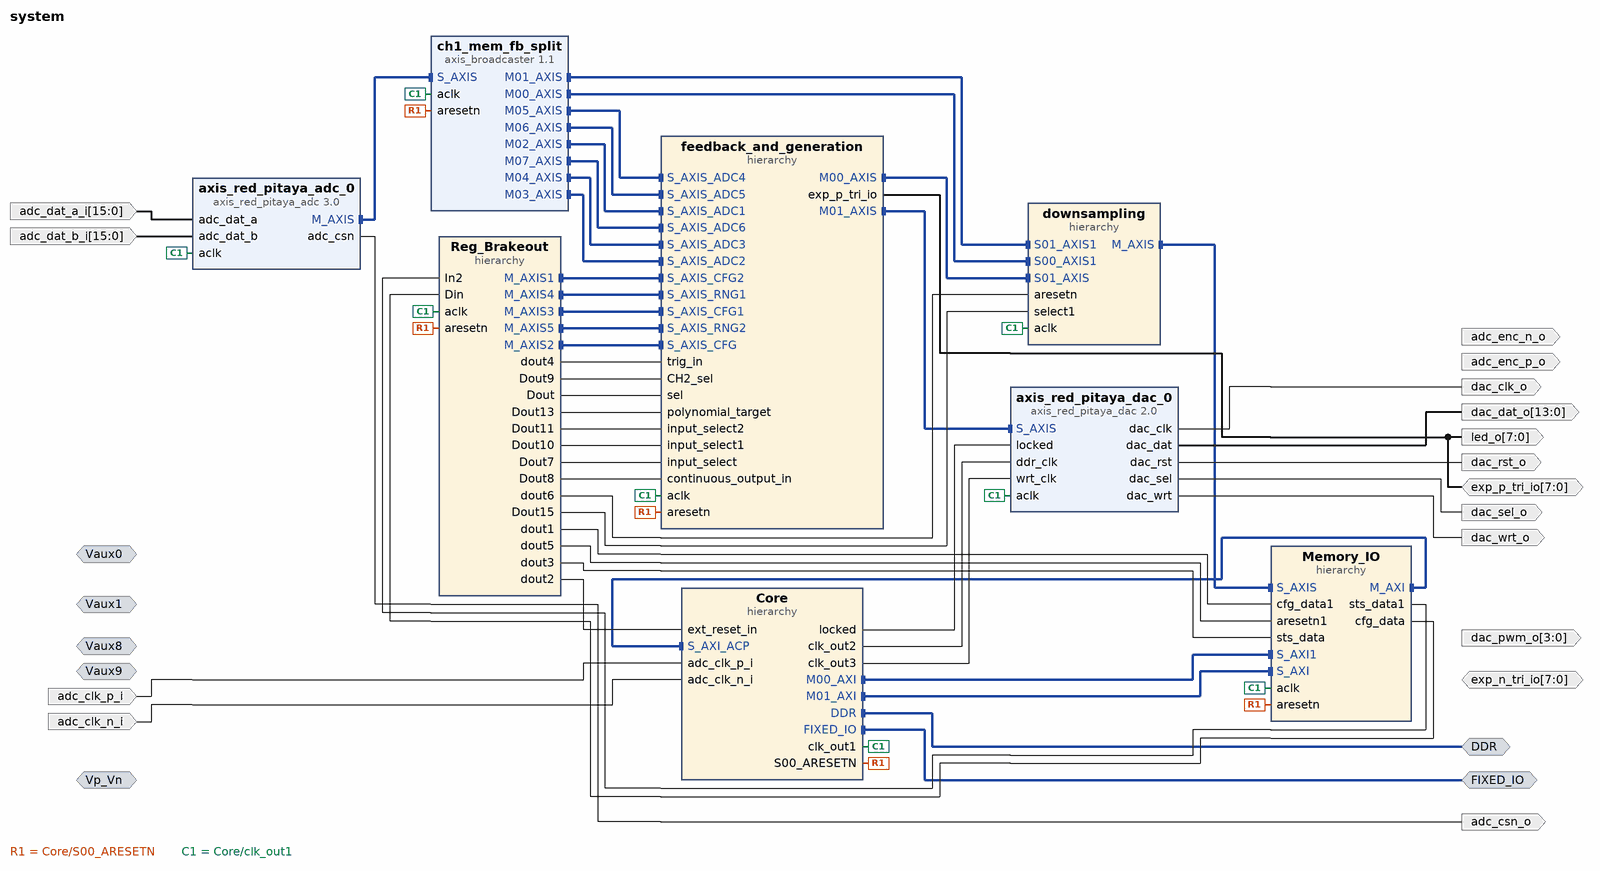
[diagram p0: block diagram of the top level]
# Vivado block design system, xc7z010clg400-1, Vivado 2020.2
create_bd_design system

create_bd_intf_port -mode Slave -vlnv xilinx.com:interface:diff_analog_io_rtl:1.0 Vp_Vn
create_bd_intf_port -mode Slave -vlnv xilinx.com:interface:diff_analog_io_rtl:1.0 Vaux0
create_bd_intf_port -mode Slave -vlnv xilinx.com:interface:diff_analog_io_rtl:1.0 Vaux1
create_bd_intf_port -mode Slave -vlnv xilinx.com:interface:diff_analog_io_rtl:1.0 Vaux9
create_bd_intf_port -mode Slave -vlnv xilinx.com:interface:diff_analog_io_rtl:1.0 Vaux8
create_bd_intf_port -mode Master -vlnv xilinx.com:interface:ddrx_rtl:1.0 DDR
create_bd_intf_port -mode Master -vlnv xilinx.com:display_processing_system7:fixedio_rtl:1.0 FIXED_IO
create_bd_port -dir I -from 15 -to 0 adc_dat_a_i
create_bd_port -dir I -from 15 -to 0 adc_dat_b_i
create_bd_port -dir I adc_clk_p_i
create_bd_port -dir I adc_clk_n_i
create_bd_port -dir O adc_enc_p_o
create_bd_port -dir O adc_enc_n_o
create_bd_port -dir O adc_csn_o
create_bd_port -dir O -from 13 -to 0 dac_dat_o
create_bd_port -dir O dac_clk_o
create_bd_port -dir O dac_rst_o
create_bd_port -dir O dac_sel_o
create_bd_port -dir O dac_wrt_o
create_bd_port -dir O -from 3 -to 0 dac_pwm_o
create_bd_port -dir IO -from 7 -to 0 exp_p_tri_io
create_bd_port -dir IO -from 7 -to 0 exp_n_tri_io
create_bd_port -dir O -from 7 -to 0 led_o

create_bd_cell -type hier Core
create_bd_cell -type hier Memory_IO
create_bd_cell -type hier Reg_Brakeout
create_bd_cell -type ip -vlnv xilinx.com:user:axis_red_pitaya_adc:3.0 axis_red_pitaya_adc_0
create_bd_cell -type ip -vlnv xilinx.com:ip:axis_broadcaster:1.1 ch1_mem_fb_split
set_property -dict [list \
  CONFIG.M00_TDATA_REMAP {tdata[15:0]} \
  CONFIG.M01_TDATA_REMAP {tdata[31:16]} \
  CONFIG.M02_TDATA_REMAP {tdata[15:0]} \
  CONFIG.M03_TDATA_REMAP {tdata[31:16]} \
  CONFIG.M04_TDATA_REMAP {tdata[15:0]} \
  CONFIG.M05_TDATA_REMAP {tdata[31:16]} \
  CONFIG.M06_TDATA_REMAP {tdata[15:0]} \
  CONFIG.M07_TDATA_REMAP {tdata[31:16]} \
  CONFIG.M_TDATA_NUM_BYTES 2 \
  CONFIG.NUM_MI 8 \
  CONFIG.S_TDATA_NUM_BYTES 4 \
] [get_bd_cells ch1_mem_fb_split]
create_bd_cell -type hier feedback_and_generation
create_bd_cell -type ip -vlnv xilinx.com:user:axis_red_pitaya_dac:2.0 axis_red_pitaya_dac_0
create_bd_cell -type hier downsampling

# ---- hierarchy /Core ----
current_bd_instance /Core
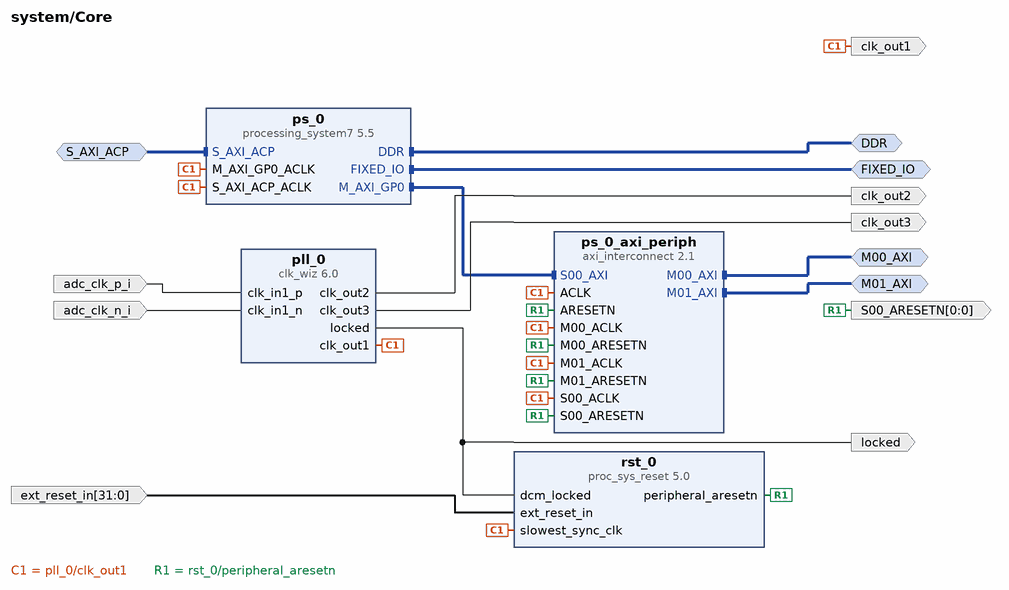
[diagram p1: block diagram inside /Core]
create_bd_intf_pin -mode Master -vlnv xilinx.com:interface:ddrx_rtl:1.0 DDR
create_bd_intf_pin -mode Master -vlnv xilinx.com:display_processing_system7:fixedio_rtl:1.0 FIXED_IO
create_bd_intf_pin -mode Slave -vlnv xilinx.com:interface:aximm_rtl:1.0 S_AXI_ACP
create_bd_intf_pin -mode Master -vlnv xilinx.com:interface:aximm_rtl:1.0 M00_AXI
create_bd_intf_pin -mode Master -vlnv xilinx.com:interface:aximm_rtl:1.0 M01_AXI
create_bd_pin -dir O -type clk clk_out1
create_bd_pin -dir I -from 31 -to 0 -type rst ext_reset_in
create_bd_pin -dir O locked
create_bd_pin -dir O -from 0 -to 0 -type rst S00_ARESETN
create_bd_pin -dir I adc_clk_p_i
create_bd_pin -dir I adc_clk_n_i
create_bd_pin -dir O -type clk clk_out2
create_bd_pin -dir O -type clk clk_out3

create_bd_cell -type ip -vlnv xilinx.com:ip:proc_sys_reset:5.0 rst_0
create_bd_cell -type ip -vlnv xilinx.com:ip:clk_wiz:6.0 pll_0
set_property -dict [list \
  CONFIG.CLKOUT1_REQUESTED_OUT_FREQ 125.0 \
  CONFIG.CLKOUT1_USED true \
  CONFIG.CLKOUT2_REQUESTED_OUT_FREQ 250.0 \
  CONFIG.CLKOUT2_REQUESTED_PHASE 157.5 \
  CONFIG.CLKOUT2_USED true \
  CONFIG.CLKOUT3_REQUESTED_OUT_FREQ 250.0 \
  CONFIG.CLKOUT3_REQUESTED_PHASE 202.5 \
  CONFIG.CLKOUT3_USED true \
  CONFIG.CLKOUT4_JITTER 119.348 \
  CONFIG.CLKOUT4_PHASE_ERROR 96.948 \
  CONFIG.CLKOUT4_REQUESTED_OUT_FREQ 100.000 \
  CONFIG.CLKOUT4_USED false \
  CONFIG.CLKOUT5_JITTER 119.348 \
  CONFIG.CLKOUT5_PHASE_ERROR 96.948 \
  CONFIG.CLKOUT5_REQUESTED_OUT_FREQ 100.000 \
  CONFIG.CLKOUT5_USED false \
  CONFIG.CLKOUT6_JITTER 119.348 \
  CONFIG.CLKOUT6_PHASE_ERROR 96.948 \
  CONFIG.CLKOUT6_REQUESTED_OUT_FREQ 100.000 \
  CONFIG.CLKOUT6_USED false \
  CONFIG.MMCM_CLKOUT3_DIVIDE 1 \
  CONFIG.MMCM_CLKOUT4_DIVIDE 1 \
  CONFIG.MMCM_CLKOUT5_DIVIDE 1 \
  CONFIG.NUM_OUT_CLKS 3 \
  CONFIG.PRIMITIVE PLL \
  CONFIG.PRIM_IN_FREQ 125.0 \
  CONFIG.PRIM_SOURCE Differential_clock_capable_pin \
  CONFIG.USE_RESET false \
] [get_bd_cells pll_0]
create_bd_cell -type ip -vlnv xilinx.com:ip:processing_system7:5.5 ps_0
set_property -dict [list \
  CONFIG.PCW_APU_PERIPHERAL_FREQMHZ 666.666666 \
  CONFIG.PCW_ENET0_ENET0_IO {MIO 16 .. 27} \
  CONFIG.PCW_ENET0_GRP_MDIO_ENABLE 1 \
  CONFIG.PCW_ENET0_GRP_MDIO_IO {MIO 52 .. 53} \
  CONFIG.PCW_ENET0_PERIPHERAL_ENABLE 1 \
  CONFIG.PCW_ENET0_RESET_ENABLE 0 \
  CONFIG.PCW_ENET_RESET_ENABLE 1 \
  CONFIG.PCW_ENET_RESET_SELECT {Share reset pin} \
  CONFIG.PCW_FPGA0_PERIPHERAL_FREQMHZ 50 \
  CONFIG.PCW_FPGA1_PERIPHERAL_FREQMHZ 50 \
  CONFIG.PCW_GPIO_EMIO_GPIO_ENABLE 1 \
  CONFIG.PCW_GPIO_EMIO_GPIO_IO 64 \
  CONFIG.PCW_GPIO_MIO_GPIO_ENABLE 1 \
  CONFIG.PCW_GPIO_MIO_GPIO_IO MIO \
  CONFIG.PCW_GPIO_PERIPHERAL_ENABLE 1 \
  CONFIG.PCW_I2C0_GRP_INT_ENABLE 0 \
  CONFIG.PCW_I2C0_I2C0_IO {MIO 50 .. 51} \
  CONFIG.PCW_I2C0_PERIPHERAL_ENABLE 1 \
  CONFIG.PCW_I2C_PERIPHERAL_FREQMHZ 111.111115 \
  CONFIG.PCW_I2C_RESET_ENABLE 1 \
  CONFIG.PCW_I2C_RESET_SELECT {Share reset pin} \
  CONFIG.PCW_IMPORT_BOARD_PRESET cfg/red_pitaya.xml \
  CONFIG.PCW_PRESET_BANK1_VOLTAGE {LVCMOS 2.5V} \
  CONFIG.PCW_QSPI_PERIPHERAL_ENABLE 0 \
  CONFIG.PCW_SD0_GRP_CD_ENABLE 1 \
  CONFIG.PCW_SD0_GRP_CD_IO {MIO 46} \
  CONFIG.PCW_SD0_GRP_WP_ENABLE 1 \
  CONFIG.PCW_SD0_GRP_WP_IO {MIO 47} \
  CONFIG.PCW_SD0_PERIPHERAL_ENABLE 1 \
  CONFIG.PCW_SD0_SD0_IO {MIO 40 .. 45} \
  CONFIG.PCW_SDIO_PERIPHERAL_FREQMHZ 100 \
  CONFIG.PCW_SPI0_PERIPHERAL_ENABLE 1 \
  CONFIG.PCW_SPI0_SPI0_IO EMIO \
  CONFIG.PCW_SPI1_PERIPHERAL_ENABLE 1 \
  CONFIG.PCW_SPI1_SPI1_IO {MIO 10 .. 15} \
  CONFIG.PCW_UART0_PERIPHERAL_ENABLE 1 \
  CONFIG.PCW_UART0_UART0_IO {MIO 14 .. 15} \
  CONFIG.PCW_UART1_PERIPHERAL_ENABLE 1 \
  CONFIG.PCW_UART1_UART1_IO {MIO 8 .. 9} \
  CONFIG.PCW_UART_PERIPHERAL_FREQMHZ 100 \
  CONFIG.PCW_UIPARAM_DDR_BUS_WIDTH {16 Bit} \
  CONFIG.PCW_UIPARAM_DDR_FREQ_MHZ 533.333333 \
  CONFIG.PCW_UIPARAM_DDR_PARTNO {MT41J256M16 RE-125} \
  CONFIG.PCW_USB0_PERIPHERAL_ENABLE 1 \
  CONFIG.PCW_USB0_RESET_ENABLE 1 \
  CONFIG.PCW_USB0_RESET_IO {MIO 48} \
  CONFIG.PCW_USB0_USB0_IO {MIO 28 .. 39} \
  CONFIG.PCW_USB_RESET_ENABLE 1 \
  CONFIG.PCW_USB_RESET_SELECT {Share reset pin} \
  CONFIG.PCW_USE_DEFAULT_ACP_USER_VAL 1 \
  CONFIG.PCW_USE_S_AXI_ACP 1 \
] [get_bd_cells ps_0]
# 429 more settings of ps_0 are not shown: defaults, MIO pin electricals, DDR timing, and values the tool derives
create_bd_cell -type ip -vlnv xilinx.com:ip:axi_interconnect:2.1 ps_0_axi_periph
set_property -dict {CONFIG.NUM_MI 2} [get_bd_cells ps_0_axi_periph]

# ---- hierarchy /Memory_IO ----
current_bd_instance /Memory_IO
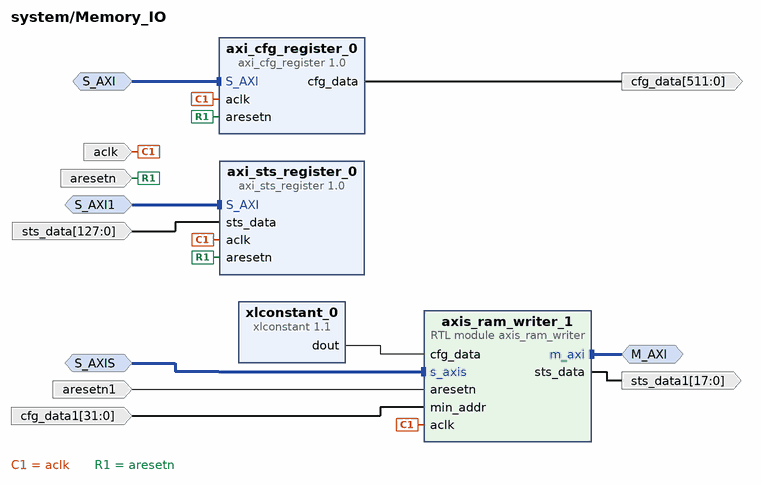
[diagram p2: block diagram inside /Memory_IO]
create_bd_intf_pin -mode Slave -vlnv xilinx.com:interface:aximm_rtl:1.0 S_AXI
create_bd_intf_pin -mode Slave -vlnv xilinx.com:interface:aximm_rtl:1.0 S_AXI1
create_bd_intf_pin -mode Slave -vlnv xilinx.com:interface:axis_rtl:1.0 S_AXIS
create_bd_intf_pin -mode Master -vlnv xilinx.com:interface:aximm_rtl:1.0 M_AXI
create_bd_pin -dir I -type clk aclk
create_bd_pin -dir I -type rst aresetn
create_bd_pin -dir I -from 127 -to 0 sts_data
create_bd_pin -dir I -type rst aresetn1
create_bd_pin -dir I -from 31 -to 0 cfg_data1
create_bd_pin -dir O -from 17 -to 0 sts_data1
create_bd_pin -dir O -from 511 -to 0 cfg_data

create_bd_cell -type ip -vlnv xilinx.com:user:axi_sts_register:1.0 axi_sts_register_0
set_property -dict {CONFIG.AXI_ADDR_WIDTH 32 CONFIG.STS_DATA_WIDTH 128} [get_bd_cells axi_sts_register_0]
create_bd_cell -type ip -vlnv xilinx.com:user:axi_cfg_register:1.0 axi_cfg_register_0
set_property -dict {CONFIG.AXI_ADDR_WIDTH 32 CONFIG.CFG_DATA_WIDTH 512} [get_bd_cells axi_cfg_register_0]
create_bd_cell -type ip -vlnv xilinx.com:ip:xlconstant:1.1 xlconstant_0
set_property -dict {CONFIG.CONST_VAL 65535 CONFIG.CONST_WIDTH 18} [get_bd_cells xlconstant_0]
create_bd_cell -type module -reference axis_ram_writer axis_ram_writer_1
set_property -dict {CONFIG.ADDR_WIDTH 18 CONFIG.AXI_ID_WIDTH 3} [get_bd_cells axis_ram_writer_1]

# ---- hierarchy /Reg_Brakeout ----
current_bd_instance /Reg_Brakeout
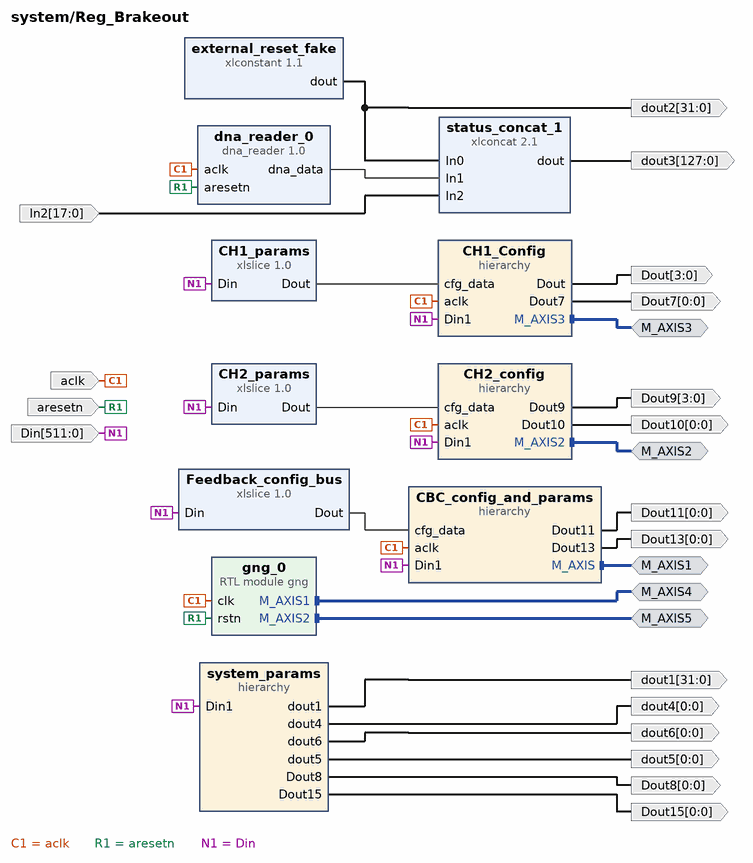
[diagram p3: block diagram inside /Reg_Brakeout]
create_bd_intf_pin -mode Master -vlnv xilinx.com:interface:axis_rtl:1.0 M_AXIS2
create_bd_intf_pin -mode Master -vlnv xilinx.com:interface:axis_rtl:1.0 M_AXIS3
create_bd_intf_pin -mode Master -vlnv xilinx.com:interface:axis_rtl:1.0 M_AXIS1
create_bd_intf_pin -mode Master -vlnv xilinx.com:interface:axis_rtl:1.0 M_AXIS4
create_bd_intf_pin -mode Master -vlnv xilinx.com:interface:axis_rtl:1.0 M_AXIS5
create_bd_pin -dir I -type clk aclk
create_bd_pin -dir I -type rst aresetn
create_bd_pin -dir O -from 31 -to 0 dout1
create_bd_pin -dir O -from 31 -to 0 dout2
create_bd_pin -dir O -from 0 -to 0 dout4
create_bd_pin -dir O -from 0 -to 0 dout5
create_bd_pin -dir O -from 0 -to 0 dout6
create_bd_pin -dir O -from 0 -to 0 Dout8
create_bd_pin -dir O -from 127 -to 0 dout3
create_bd_pin -dir I -from 17 -to 0 In2
create_bd_pin -dir O -from 0 -to 0 Dout7
create_bd_pin -dir O -from 3 -to 0 Dout
create_bd_pin -dir O -from 0 -to 0 Dout10
create_bd_pin -dir O -from 3 -to 0 Dout9
create_bd_pin -dir O -from 0 -to 0 Dout11
create_bd_pin -dir O -from 0 -to 0 Dout13
create_bd_pin -dir I -from 511 -to 0 Din
create_bd_pin -dir O -from 0 -to 0 Dout15

create_bd_cell -type ip -vlnv xilinx.com:ip:xlconstant:1.1 external_reset_fake
set_property -dict {CONFIG.CONST_WIDTH 32} [get_bd_cells external_reset_fake]
create_bd_cell -type ip -vlnv xilinx.com:user:dna_reader:1.0 dna_reader_0
create_bd_cell -type ip -vlnv xilinx.com:ip:xlslice:1.0 Feedback_config_bus
set_property -dict [list \
  CONFIG.DIN_FROM 511 \
  CONFIG.DIN_TO 64 \
  CONFIG.DIN_WIDTH 512 \
  CONFIG.DOUT_WIDTH 448 \
] [get_bd_cells Feedback_config_bus]
create_bd_cell -type ip -vlnv xilinx.com:ip:xlconcat:2.1 status_concat_1
set_property -dict {CONFIG.IN0_WIDTH 32 CONFIG.IN1_WIDTH 64 CONFIG.IN2_WIDTH 32 CONFIG.NUM_PORTS 3} [get_bd_cells status_concat_1]
create_bd_cell -type hier CH1_Config
create_bd_cell -type hier system_params
create_bd_cell -type ip -vlnv xilinx.com:ip:xlslice:1.0 CH1_params
set_property -dict {CONFIG.DIN_FROM 255 CONFIG.DIN_TO 64 CONFIG.DIN_WIDTH 512 CONFIG.DOUT_WIDTH 192} [get_bd_cells CH1_params]
create_bd_cell -type ip -vlnv xilinx.com:ip:xlslice:1.0 CH2_params
set_property -dict {CONFIG.DIN_FROM 447 CONFIG.DIN_TO 256 CONFIG.DIN_WIDTH 512 CONFIG.DOUT_WIDTH 192} [get_bd_cells CH2_params]
create_bd_cell -type hier CH2_config
create_bd_cell -type module -reference gng gng_0
create_bd_cell -type hier CBC_config_and_params

# ---- hierarchy /Reg_Brakeout/CH1_Config ----
current_bd_instance /Reg_Brakeout/CH1_Config
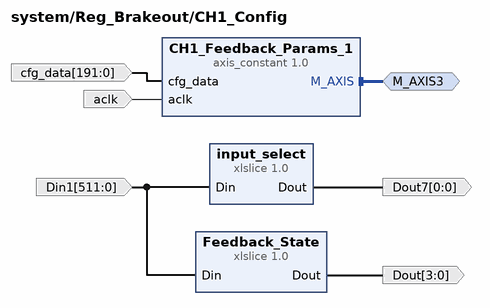
[diagram p4: block diagram inside /Reg_Brakeout/CH1_Config]
create_bd_intf_pin -mode Master -vlnv xilinx.com:interface:axis_rtl:1.0 M_AXIS3
create_bd_pin -dir O -from 0 -to 0 Dout7
create_bd_pin -dir O -from 3 -to 0 Dout
create_bd_pin -dir I -from 191 -to 0 cfg_data
create_bd_pin -dir I -type clk aclk
create_bd_pin -dir I -from 511 -to 0 Din1

create_bd_cell -type ip -vlnv xilinx.com:ip:xlslice:1.0 Feedback_State
set_property -dict {CONFIG.DIN_FROM 12 CONFIG.DIN_TO 9 CONFIG.DIN_WIDTH 512 CONFIG.DOUT_WIDTH 4} [get_bd_cells Feedback_State]
create_bd_cell -type ip -vlnv xilinx.com:ip:xlslice:1.0 input_select
set_property -dict {CONFIG.DIN_FROM 8 CONFIG.DIN_TO 8 CONFIG.DIN_WIDTH 512 CONFIG.DOUT_WIDTH 1} [get_bd_cells input_select]
create_bd_cell -type ip -vlnv xilinx.com:user:axis_constant:1.0 CH1_Feedback_Params_1
set_property -dict {CONFIG.AXIS_TDATA_WIDTH 192} [get_bd_cells CH1_Feedback_Params_1]

# ---- hierarchy /Reg_Brakeout/system_params ----
current_bd_instance /Reg_Brakeout/system_params
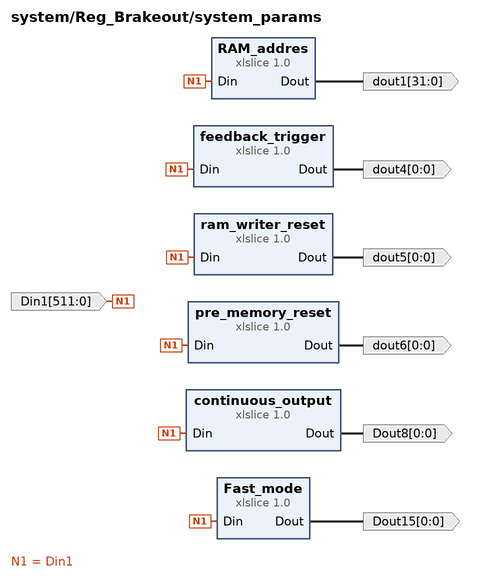
[diagram p5: block diagram inside /Reg_Brakeout/system_params]
create_bd_pin -dir O -from 0 -to 0 dout5
create_bd_pin -dir O -from 0 -to 0 Dout8
create_bd_pin -dir O -from 0 -to 0 dout4
create_bd_pin -dir O -from 0 -to 0 dout6
create_bd_pin -dir O -from 31 -to 0 dout1
create_bd_pin -dir I -from 511 -to 0 Din1
create_bd_pin -dir O -from 0 -to 0 Dout15

create_bd_cell -type ip -vlnv xilinx.com:ip:xlslice:1.0 ram_writer_reset
set_property -dict {CONFIG.DIN_FROM 1 CONFIG.DIN_TO 1 CONFIG.DIN_WIDTH 512 CONFIG.DOUT_WIDTH 1} [get_bd_cells ram_writer_reset]
create_bd_cell -type ip -vlnv xilinx.com:ip:xlslice:1.0 continuous_output
set_property -dict {CONFIG.DIN_FROM 3 CONFIG.DIN_TO 3 CONFIG.DIN_WIDTH 512 CONFIG.DOUT_WIDTH 1} [get_bd_cells continuous_output]
create_bd_cell -type ip -vlnv xilinx.com:ip:xlslice:1.0 feedback_trigger
set_property -dict {CONFIG.DIN_FROM 2 CONFIG.DIN_TO 2 CONFIG.DIN_WIDTH 512 CONFIG.DOUT_WIDTH 1} [get_bd_cells feedback_trigger]
create_bd_cell -type ip -vlnv xilinx.com:ip:xlslice:1.0 pre_memory_reset
set_property -dict {CONFIG.DIN_FROM 0 CONFIG.DIN_TO 0 CONFIG.DIN_WIDTH 512 CONFIG.DOUT_WIDTH 1} [get_bd_cells pre_memory_reset]
create_bd_cell -type ip -vlnv xilinx.com:ip:xlslice:1.0 RAM_addres
set_property -dict {CONFIG.DIN_FROM 63 CONFIG.DIN_TO 32 CONFIG.DIN_WIDTH 512 CONFIG.DOUT_WIDTH 32} [get_bd_cells RAM_addres]
create_bd_cell -type ip -vlnv xilinx.com:ip:xlslice:1.0 Fast_mode
set_property -dict {CONFIG.DIN_FROM 4 CONFIG.DIN_TO 4 CONFIG.DIN_WIDTH 512 CONFIG.DOUT_WIDTH 1} [get_bd_cells Fast_mode]

# ---- hierarchy /Reg_Brakeout/CH2_config ----
current_bd_instance /Reg_Brakeout/CH2_config
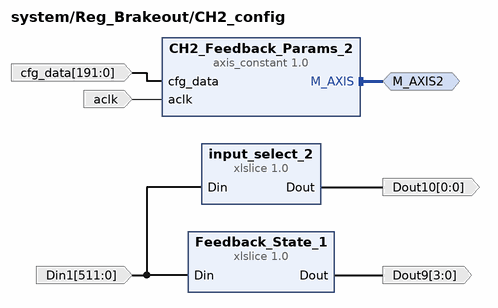
[diagram p6: block diagram inside /Reg_Brakeout/CH2_config]
create_bd_intf_pin -mode Master -vlnv xilinx.com:interface:axis_rtl:1.0 M_AXIS2
create_bd_pin -dir O -from 3 -to 0 Dout9
create_bd_pin -dir O -from 0 -to 0 Dout10
create_bd_pin -dir I -from 191 -to 0 cfg_data
create_bd_pin -dir I -type clk aclk
create_bd_pin -dir I -from 511 -to 0 Din1

create_bd_cell -type ip -vlnv xilinx.com:ip:xlslice:1.0 Feedback_State_1
set_property -dict {CONFIG.DIN_FROM 20 CONFIG.DIN_TO 17 CONFIG.DIN_WIDTH 512 CONFIG.DOUT_WIDTH 4} [get_bd_cells Feedback_State_1]
create_bd_cell -type ip -vlnv xilinx.com:ip:xlslice:1.0 input_select_2
set_property -dict {CONFIG.DIN_FROM 16 CONFIG.DIN_TO 16 CONFIG.DIN_WIDTH 512 CONFIG.DOUT_WIDTH 1} [get_bd_cells input_select_2]
create_bd_cell -type ip -vlnv xilinx.com:user:axis_constant:1.0 CH2_Feedback_Params_2
set_property -dict {CONFIG.AXIS_TDATA_WIDTH 192} [get_bd_cells CH2_Feedback_Params_2]

# ---- hierarchy /Reg_Brakeout/CBC_config_and_params ----
current_bd_instance /Reg_Brakeout/CBC_config_and_params
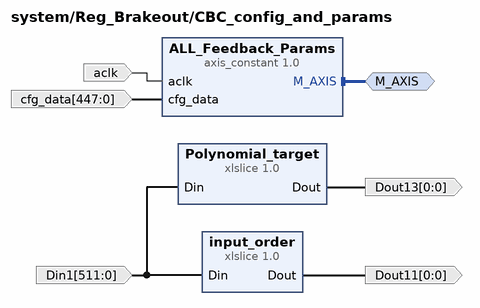
[diagram p7: block diagram inside /Reg_Brakeout/CBC_config_and_params]
create_bd_intf_pin -mode Master -vlnv xilinx.com:interface:axis_rtl:1.0 M_AXIS
create_bd_pin -dir I -from 511 -to 0 Din1
create_bd_pin -dir O -from 0 -to 0 Dout13
create_bd_pin -dir I -type clk aclk
create_bd_pin -dir I -from 447 -to 0 cfg_data
create_bd_pin -dir O -from 0 -to 0 Dout11

create_bd_cell -type ip -vlnv xilinx.com:ip:xlslice:1.0 Polynomial_target
set_property -dict {CONFIG.DIN_FROM 27 CONFIG.DIN_TO 27 CONFIG.DIN_WIDTH 512 CONFIG.DOUT_WIDTH 1} [get_bd_cells Polynomial_target]
create_bd_cell -type ip -vlnv xilinx.com:user:axis_constant:1.0 ALL_Feedback_Params
set_property -dict {CONFIG.AXIS_TDATA_WIDTH 448} [get_bd_cells ALL_Feedback_Params]
create_bd_cell -type ip -vlnv xilinx.com:ip:xlslice:1.0 input_order
set_property -dict {CONFIG.DIN_FROM 24 CONFIG.DIN_TO 24 CONFIG.DIN_WIDTH 512 CONFIG.DOUT_WIDTH 1} [get_bd_cells input_order]

# ---- hierarchy /feedback_and_generation ----
current_bd_instance /feedback_and_generation
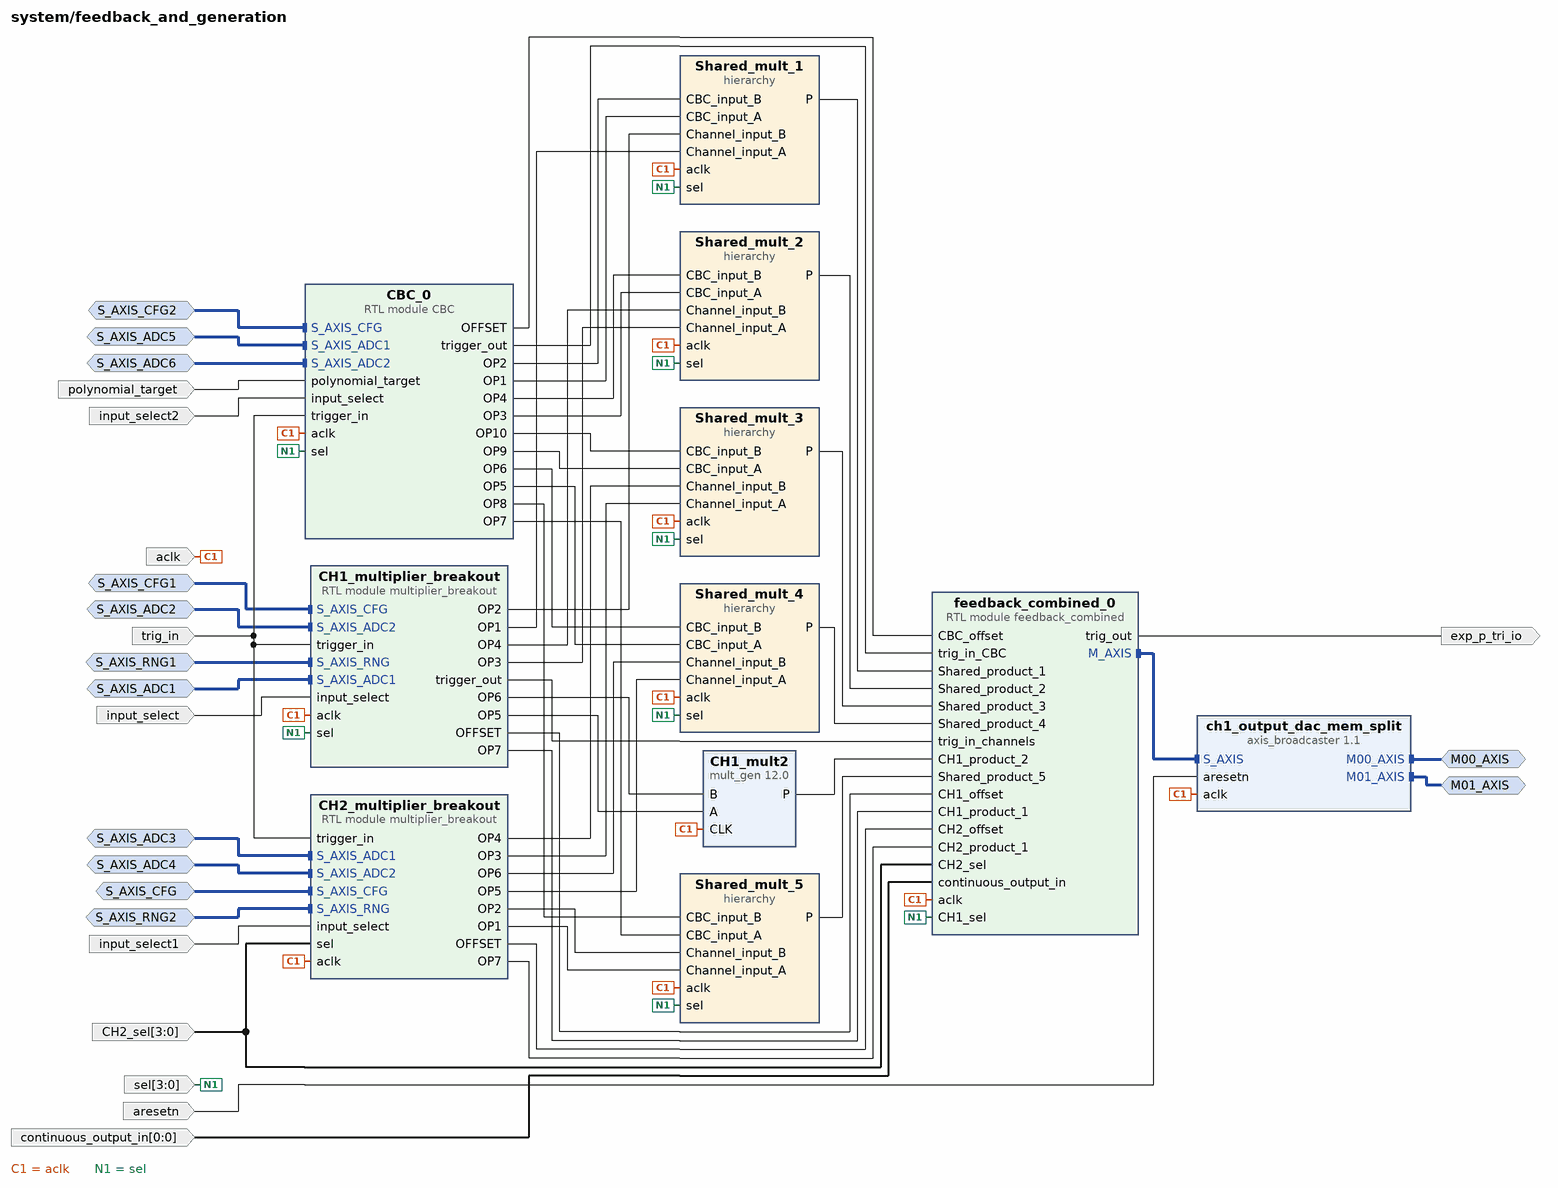
[diagram p8: block diagram inside /feedback_and_generation]
create_bd_intf_pin -mode Slave -vlnv xilinx.com:interface:axis_rtl:1.0 S_AXIS_CFG2
create_bd_intf_pin -mode Slave -vlnv xilinx.com:interface:axis_rtl:1.0 S_AXIS_ADC6
create_bd_intf_pin -mode Slave -vlnv xilinx.com:interface:axis_rtl:1.0 S_AXIS_ADC5
create_bd_intf_pin -mode Slave -vlnv xilinx.com:interface:axis_rtl:1.0 S_AXIS_RNG2
create_bd_intf_pin -mode Slave -vlnv xilinx.com:interface:axis_rtl:1.0 S_AXIS_CFG
create_bd_intf_pin -mode Slave -vlnv xilinx.com:interface:axis_rtl:1.0 S_AXIS_ADC4
create_bd_intf_pin -mode Slave -vlnv xilinx.com:interface:axis_rtl:1.0 S_AXIS_ADC3
create_bd_intf_pin -mode Slave -vlnv xilinx.com:interface:axis_rtl:1.0 S_AXIS_RNG1
create_bd_intf_pin -mode Slave -vlnv xilinx.com:interface:axis_rtl:1.0 S_AXIS_CFG1
create_bd_intf_pin -mode Slave -vlnv xilinx.com:interface:axis_rtl:1.0 S_AXIS_ADC2
create_bd_intf_pin -mode Slave -vlnv xilinx.com:interface:axis_rtl:1.0 S_AXIS_ADC1
create_bd_intf_pin -mode Master -vlnv xilinx.com:interface:axis_rtl:1.0 M01_AXIS
create_bd_intf_pin -mode Master -vlnv xilinx.com:interface:axis_rtl:1.0 M00_AXIS
create_bd_pin -dir I -type clk aclk
create_bd_pin -dir I trig_in
create_bd_pin -dir I -from 3 -to 0 CH2_sel
create_bd_pin -dir I -from 3 -to 0 sel
create_bd_pin -dir I polynomial_target
create_bd_pin -dir I input_select2
create_bd_pin -dir I input_select1
create_bd_pin -dir I input_select
create_bd_pin -dir I -type rst aresetn
create_bd_pin -dir O exp_p_tri_io
create_bd_pin -dir I -from 0 -to 0 continuous_output_in

create_bd_cell -type hier Shared_mult_5
create_bd_cell -type hier Shared_mult_2
create_bd_cell -type ip -vlnv xilinx.com:ip:mult_gen:12.0 CH1_mult2
set_property -dict [list \
  CONFIG.Multiplier_Construction Use_Mults \
  CONFIG.OutputWidthHigh 63 \
  CONFIG.OutputWidthLow 21 \
  CONFIG.PipeStages 4 \
  CONFIG.PortAType Signed \
  CONFIG.PortAWidth 32 \
  CONFIG.PortBType Signed \
  CONFIG.PortBWidth 48 \
  CONFIG.Use_Custom_Output_Width true \
] [get_bd_cells CH1_mult2]
create_bd_cell -type ip -vlnv xilinx.com:ip:axis_broadcaster:1.1 ch1_output_dac_mem_split
set_property -dict [list \
  CONFIG.M00_TDATA_REMAP {tdata[31:0]} \
  CONFIG.M01_TDATA_REMAP {tdata[31:0]} \
  CONFIG.M_TDATA_NUM_BYTES 4 \
  CONFIG.S_TDATA_NUM_BYTES 4 \
] [get_bd_cells ch1_output_dac_mem_split]
create_bd_cell -type hier Shared_mult_4
create_bd_cell -type hier Shared_mult_3
create_bd_cell -type hier Shared_mult_1
create_bd_cell -type module -reference CBC CBC_0
create_bd_cell -type module -reference feedback_combined feedback_combined_0
create_bd_cell -type module -reference multiplier_breakout CH2_multiplier_breakout
create_bd_cell -type module -reference multiplier_breakout CH1_multiplier_breakout

# ---- hierarchy /feedback_and_generation/Shared_mult_5 ----
current_bd_instance /feedback_and_generation/Shared_mult_5
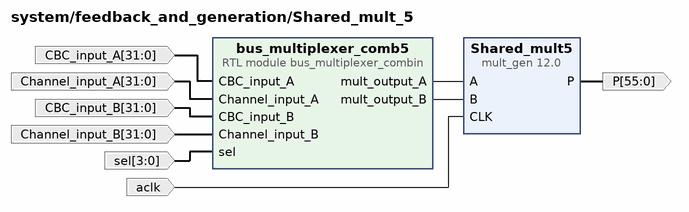
[diagram p9: block diagram inside /feedback_and_generation/Shared_mult_5]
create_bd_pin -dir I -from 31 -to 0 CBC_input_A
create_bd_pin -dir I -from 31 -to 0 Channel_input_A
create_bd_pin -dir I -from 31 -to 0 CBC_input_B
create_bd_pin -dir I -from 31 -to 0 Channel_input_B
create_bd_pin -dir I -from 3 -to 0 sel
create_bd_pin -dir I -type clk aclk
create_bd_pin -dir O -from 55 -to 0 -type data P

create_bd_cell -type module -reference bus_multiplexer_combin bus_multiplexer_comb5
create_bd_cell -type ip -vlnv xilinx.com:ip:mult_gen:12.0 Shared_mult5
set_property -dict [list \
  CONFIG.Multiplier_Construction Use_Mults \
  CONFIG.OutputWidthHigh 63 \
  CONFIG.OutputWidthLow 8 \
  CONFIG.PipeStages 4 \
  CONFIG.PortAType Signed \
  CONFIG.PortAWidth 32 \
  CONFIG.PortBType Signed \
  CONFIG.PortBWidth 32 \
  CONFIG.Use_Custom_Output_Width true \
] [get_bd_cells Shared_mult5]

# ---- hierarchy /feedback_and_generation/Shared_mult_2 ----
current_bd_instance /feedback_and_generation/Shared_mult_2
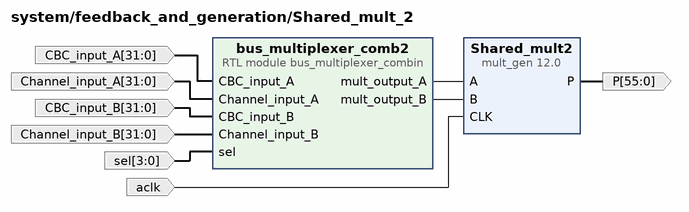
[diagram p10: block diagram inside /feedback_and_generation/Shared_mult_2]
create_bd_pin -dir I -from 31 -to 0 CBC_input_A
create_bd_pin -dir I -from 31 -to 0 Channel_input_A
create_bd_pin -dir I -from 31 -to 0 CBC_input_B
create_bd_pin -dir I -from 31 -to 0 Channel_input_B
create_bd_pin -dir I -from 3 -to 0 sel
create_bd_pin -dir I -type clk aclk
create_bd_pin -dir O -from 55 -to 0 -type data P

create_bd_cell -type module -reference bus_multiplexer_combin bus_multiplexer_comb2
create_bd_cell -type ip -vlnv xilinx.com:ip:mult_gen:12.0 Shared_mult2
set_property -dict [list \
  CONFIG.Multiplier_Construction Use_Mults \
  CONFIG.OutputWidthHigh 63 \
  CONFIG.OutputWidthLow 8 \
  CONFIG.PipeStages 4 \
  CONFIG.PortAType Signed \
  CONFIG.PortAWidth 32 \
  CONFIG.PortBType Signed \
  CONFIG.PortBWidth 32 \
  CONFIG.Use_Custom_Output_Width true \
] [get_bd_cells Shared_mult2]

# ---- hierarchy /feedback_and_generation/Shared_mult_4 ----
current_bd_instance /feedback_and_generation/Shared_mult_4
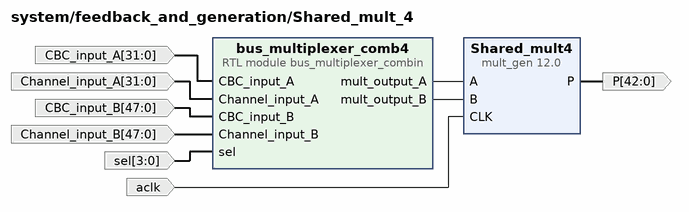
[diagram p11: block diagram inside /feedback_and_generation/Shared_mult_4]
create_bd_pin -dir I -from 31 -to 0 CBC_input_A
create_bd_pin -dir I -from 31 -to 0 Channel_input_A
create_bd_pin -dir I -from 47 -to 0 CBC_input_B
create_bd_pin -dir I -from 47 -to 0 Channel_input_B
create_bd_pin -dir I -from 3 -to 0 sel
create_bd_pin -dir I -type clk aclk
create_bd_pin -dir O -from 42 -to 0 -type data P

create_bd_cell -type module -reference bus_multiplexer_combin bus_multiplexer_comb4
set_property -dict {CONFIG.B_WIDTH 48} [get_bd_cells bus_multiplexer_comb4]
create_bd_cell -type ip -vlnv xilinx.com:ip:mult_gen:12.0 Shared_mult4
set_property -dict [list \
  CONFIG.Multiplier_Construction Use_Mults \
  CONFIG.OutputWidthHigh 63 \
  CONFIG.OutputWidthLow 21 \
  CONFIG.PipeStages 4 \
  CONFIG.PortAType Signed \
  CONFIG.PortAWidth 32 \
  CONFIG.PortBType Signed \
  CONFIG.PortBWidth 48 \
  CONFIG.Use_Custom_Output_Width true \
] [get_bd_cells Shared_mult4]

# ---- hierarchy /feedback_and_generation/Shared_mult_3 ----
current_bd_instance /feedback_and_generation/Shared_mult_3
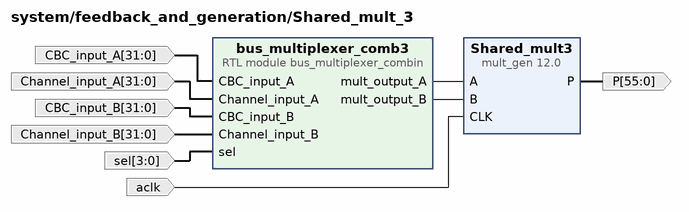
[diagram p12: block diagram inside /feedback_and_generation/Shared_mult_3]
create_bd_pin -dir I -from 31 -to 0 CBC_input_A
create_bd_pin -dir I -from 31 -to 0 Channel_input_A
create_bd_pin -dir I -from 31 -to 0 CBC_input_B
create_bd_pin -dir I -from 31 -to 0 Channel_input_B
create_bd_pin -dir I -from 3 -to 0 sel
create_bd_pin -dir I -type clk aclk
create_bd_pin -dir O -from 55 -to 0 -type data P

create_bd_cell -type module -reference bus_multiplexer_combin bus_multiplexer_comb3
create_bd_cell -type ip -vlnv xilinx.com:ip:mult_gen:12.0 Shared_mult3
set_property -dict [list \
  CONFIG.Multiplier_Construction Use_Mults \
  CONFIG.OutputWidthHigh 63 \
  CONFIG.OutputWidthLow 8 \
  CONFIG.PipeStages 4 \
  CONFIG.PortAType Signed \
  CONFIG.PortAWidth 32 \
  CONFIG.PortBType Signed \
  CONFIG.PortBWidth 32 \
  CONFIG.Use_Custom_Output_Width true \
] [get_bd_cells Shared_mult3]

# ---- hierarchy /feedback_and_generation/Shared_mult_1 ----
current_bd_instance /feedback_and_generation/Shared_mult_1
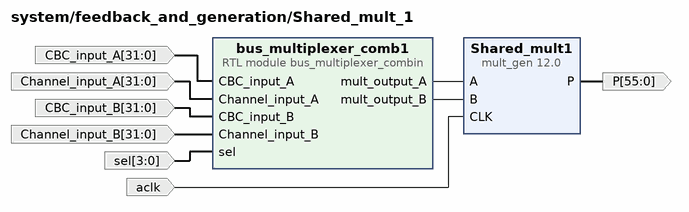
[diagram p13: block diagram inside /feedback_and_generation/Shared_mult_1]
create_bd_pin -dir I -from 31 -to 0 CBC_input_A
create_bd_pin -dir I -from 31 -to 0 Channel_input_A
create_bd_pin -dir I -from 31 -to 0 CBC_input_B
create_bd_pin -dir I -from 31 -to 0 Channel_input_B
create_bd_pin -dir I -from 3 -to 0 sel
create_bd_pin -dir I -type clk aclk
create_bd_pin -dir O -from 55 -to 0 -type data P

create_bd_cell -type module -reference bus_multiplexer_combin bus_multiplexer_comb1
create_bd_cell -type ip -vlnv xilinx.com:ip:mult_gen:12.0 Shared_mult1
set_property -dict [list \
  CONFIG.Multiplier_Construction Use_Mults \
  CONFIG.OutputWidthHigh 63 \
  CONFIG.OutputWidthLow 8 \
  CONFIG.PipeStages 4 \
  CONFIG.PortAType Signed \
  CONFIG.PortAWidth 32 \
  CONFIG.PortBType Signed \
  CONFIG.PortBWidth 32 \
  CONFIG.Use_Custom_Output_Width true \
] [get_bd_cells Shared_mult1]

# ---- hierarchy /downsampling ----
current_bd_instance /downsampling
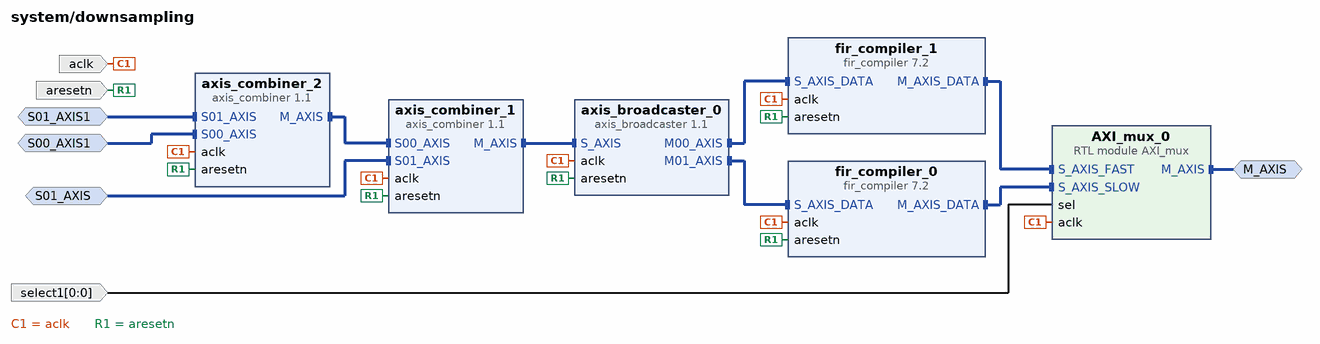
[diagram p14: block diagram inside /downsampling]
create_bd_intf_pin -mode Master -vlnv xilinx.com:interface:axis_rtl:1.0 M_AXIS
create_bd_intf_pin -mode Slave -vlnv xilinx.com:interface:axis_rtl:1.0 S00_AXIS1
create_bd_intf_pin -mode Slave -vlnv xilinx.com:interface:axis_rtl:1.0 S01_AXIS1
create_bd_intf_pin -mode Slave -vlnv xilinx.com:interface:axis_rtl:1.0 S01_AXIS
create_bd_pin -dir I -type clk aclk
create_bd_pin -dir I -type rst aresetn
create_bd_pin -dir I -from 0 -to 0 select1

create_bd_cell -type ip -vlnv xilinx.com:ip:fir_compiler:7.2 fir_compiler_0
